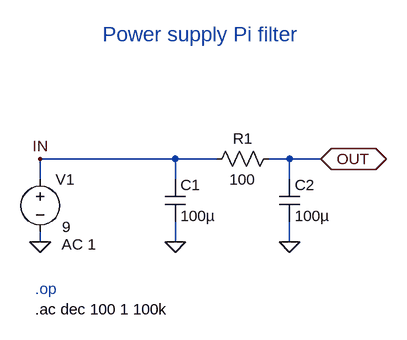
[diagram p0: schematic pi filter.asc]
pi filter.asc, the LTspice schematic file:
Version 4
SHEET 1 880 680
WIRE 192 176 -16 176
WIRE 256 176 192 176
WIRE 368 176 336 176
WIRE 416 176 368 176
WIRE -16 208 -16 176
WIRE 192 208 192 176
WIRE 368 208 368 176
WIRE -16 304 -16 288
WIRE 192 304 192 272
WIRE 368 304 368 272
FLAG 192 304 0
FLAG 368 304 0
FLAG 416 176 OUT
IOPIN 416 176 BiDir
FLAG -16 304 0
FLAG -16 176 IN
SYMBOL Res 352 160 R90
WINDOW 0 0 56 VBottom 2
WINDOW 3 32 56 VTop 2
SYMATTR InstName R1
SYMATTR Value 100
SYMBOL voltage -16 192 R0
WINDOW 3 34 89 Left 2
WINDOW 123 33 116 Left 2
SYMATTR InstName V1
SYMATTR Value 9
SYMATTR Value2 AC 1
SYMBOL Cap 176 208 R0
SYMATTR InstName C1
SYMATTR Value 100µ
SYMBOL Cap 352 208 R0
SYMATTR InstName C2
SYMATTR Value 100µ
TEXT -24 376 Left 2 ;.op
TEXT -24 408 Left 2 !.ac dec 100 1 100k
TEXT 80 -16 Left 3 ;Power supply Pi filter

The netlist it stands for:
* pi filter.asc
R1 OUT IN 100
V1 IN 0 9 AC 1
C1 IN 0 100µ
C2 OUT 0 100µ
* .op
.ac dec 100 1 100k
* Power supply Pi filter
.backanno
.end